# Altium schematic sheet mpc57_cpuio1.SchDoc: CPU I/O Bank 1
size Letter; Organization: NewAE Technology Inc.; Address1: 1083 Queen St., Suite 196; Address2: Halifax; Address3: NS; Address4: Canada B3H 0B2; SheetApproved: YES
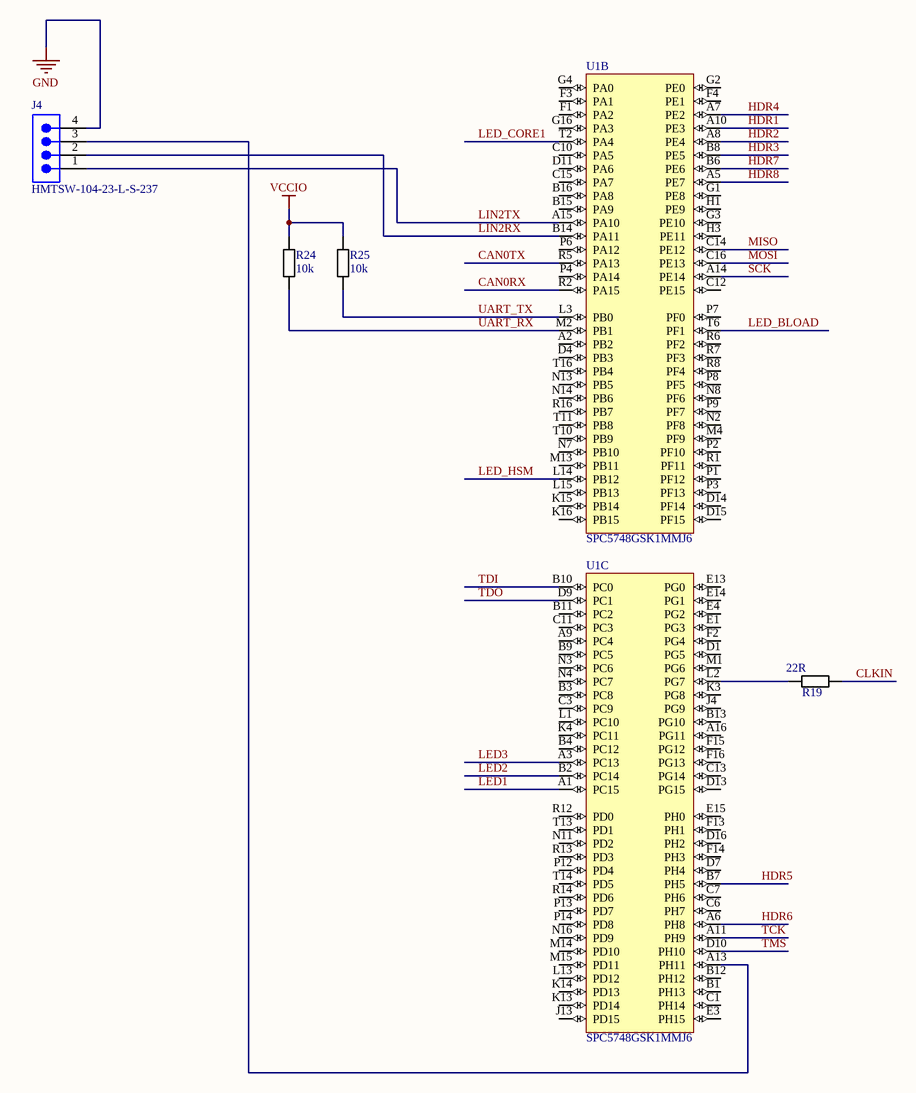
[diagram p0: mpc57_cpuio1.SchDoc]

## Parts
J4  HMTSW-104-23-L-S-237  [SMTC-HMTSW-104-23-X-S-237]
R19  22R  [RESC1608X55N]
R24  10k  [RESC1608X55N]
R25  10k  [RESC1608X55N]
U1  SPC5748GSK1MMJ6  [BGA256C100P16X16_1700X1700X170]  (parts B,C of 5)

## Nets
GND: J4.4
VCCIO: R24.1 R25.1
CAN0RX: U1.R2(PA15)
CAN0TX: U1.R5(PA13)
CLKIN: R19.2
HDR1: U1.A10(PE3)
HDR2: U1.A8(PE4)
HDR3: U1.B8(PE5)
HDR4: U1.A7(PE2)
HDR5: U1.B7(PH5)
HDR6: U1.A6(PH8)
HDR7: U1.B6(PE6)
HDR8: U1.A5(PE7)
LED1: U1.A1(PC15)
LED2: U1.B2(PC14)
LED3: U1.A3(PC13)
LED_BLOAD: U1.T6(PF1)
LED_CORE1: U1.T2(PA4)
LED_HSM: U1.L14(PB12)
LIN2RX: J4.2 U1.B14(PA11)
LIN2TX: J4.1 U1.A15(PA10)
MISO: U1.C14(PE12)
MOSI: U1.C16(PE13)
SCK: U1.A14(PE14)
TCK: U1.A11(PH9)
TDI: U1.B10(PC0)
TDO: U1.D9(PC1)
TMS: U1.D10(PH10)
UART_RX: R24.2 U1.M2(PB1)
UART_TX: R25.2 U1.L3(PB0)
NetJ4_3: J4.3 U1.A13(PH11)
NetR19_1: R19.1 U1.L2(PG7)

Not connected (* = marked no-connect by the designer): U1 A2(PB2) A9(PC4) A16(PG11) B1(PH13) B3(PC8) B4(PC12) B9(PC5) B11(PC2) B12(PH12) B13(PG10) B15(PA9) B16(PA8) C1(PH14) C3(PC9) C6(PH7) C7(PH6) C10(PA5) C11(PC3) C12(PE15) C13(PG14) C15(PA7) D1(PG5) D4(PB3) D7(PH4) D11(PA6) D13(PG15) D14(PF14) D15(PF15) D16(PH2) E1(PG3) E3(PH15) E4(PG2) E13(PG0) E14(PG1) E15(PH0) F1(PA2) F2(PG4) F3(PA1) F4(PE1) F13(PH1) F14(PH3) F15(PG12) F16(PG13) G1(PE8) G2(PE0) G3(PE10) G4(PA0) G16(PA3) H1(PE9) H3(PE11) J4(PG9) J13(PD15) K3(PG8) K4(PC11) K13(PD14) K14(PD13) K15(PB14) K16(PB15) L1(PC10) L13(PD12) L15(PB13) M1(PG6) M4(PF9) M13(PB11) M14(PD10) M15(PD11) N2(PF8) N3(PC6) N4(PC7) N7(PB10) N8(PF6) N11(PD2) N13(PB5) N14(PB6) N16(PD9) P1(PF12) P2(PF10) P3(PF13) P4(PA14) P6(PA12) P7(PF0) P8(PF5) P9(PF7) P12(PD4) P13(PD7) P14(PD8) R1(PF11) R6(PF2) R7(PF3) R8(PF4) R12(PD0) R13(PD3) R14(PD6) R16(PB7) T10(PB9) T11(PB8) T13(PD1) T14(PD5) T16(PB4)

## Notes on the sheet
- Title:
- Date:
- Rev:
- Time:
- Project:
- Sheet
- of
- License:
- Copyright © NewAE Technology Inc.
- Approved:
- NewAE.com
- File:

## Library data of the parts
J4 = CMP-1024-00020-1: Manufacturer: Samtec; Pitch: 2.54 mm; ComponentLink3URL: http://www.samtec.com/documents/webfiles/cpdf/HMTSW-XXX-XX-X-X-XXXX-XX-XX-MKT1.pdf; PartNumber: HMTSW-104-23-L-S-237; Temperature Range: -55 to 125 degC; ComponentLink1Description: Manufacturer URL; Orientation: Vertical; ComponentLink3Description: Package Specification; ComponentLink2URL: http://www.samtec.com/documents/webfiles/pdf/HMTSW.PDF; DatasheetVersion: F-214; PackageDescription: Assembly .025 [.64] SQ. Post Hi-Temp Terminal Strip; ComponentLink1URL: http://www.samtec.com; PackageReference: HMTSW-104-23-X-S-237; RoHS: True; Mounting Technology: Through-hole; ComponentLink2Description: Datasheet; PackageVersion: AL, 3/1987
R19 = RCHIP-22R-0603: 22R res, 0603, 1%, 1/10W; Manufacture 1: Yageo; Manufacture Part Number 1: RC0603FR-0722RL; Case-EIA: 0603; Case-Metric: 1608; Rated Power: 0.1W; Rated Voltage: 75VDC; Part Number: RCHIP-22R-0603; Component Kind: Standard; Component Type: Standard; Footprint: 0603; Pin Count: 2; Supplier 1: Digi-Key; Supplier Part Number 1: 311-22.0HRCT-ND; Value: 22R; Tolerance: 1%; Mounting Technology: SMT; Temperature Range: -55C to 155C
R24 R25 = RCHIP-10K-0603: 10k res, 0603, 1%, 1/10W; Manufacture 1: Yageo; Manufacture Part Number 1: RC0603FR-0710KL; Case-EIA: 0603; Case-Metric: 1608; Rated Power: 0.1W; Rated Voltage: 75VDC; Part Number: RCHIP-10K-0603; Component Kind: Standard; Component Type: Standard; Footprint: 0603; Pin Count: 2; Supplier 1: Digi-Key; Supplier Part Number 1: 311-10.0KHRCT-ND; Value: 10k; Tolerance: 1%; Mounting Technology: SMT; Temperature Range: -55C to 155C
U1 = SPC5748GSK1MMJ6: Freescale 32-bit MCU, Triple core, 6MB Flash, 160MHz, -40/+125degC, Automotive Qualified, BGA 256